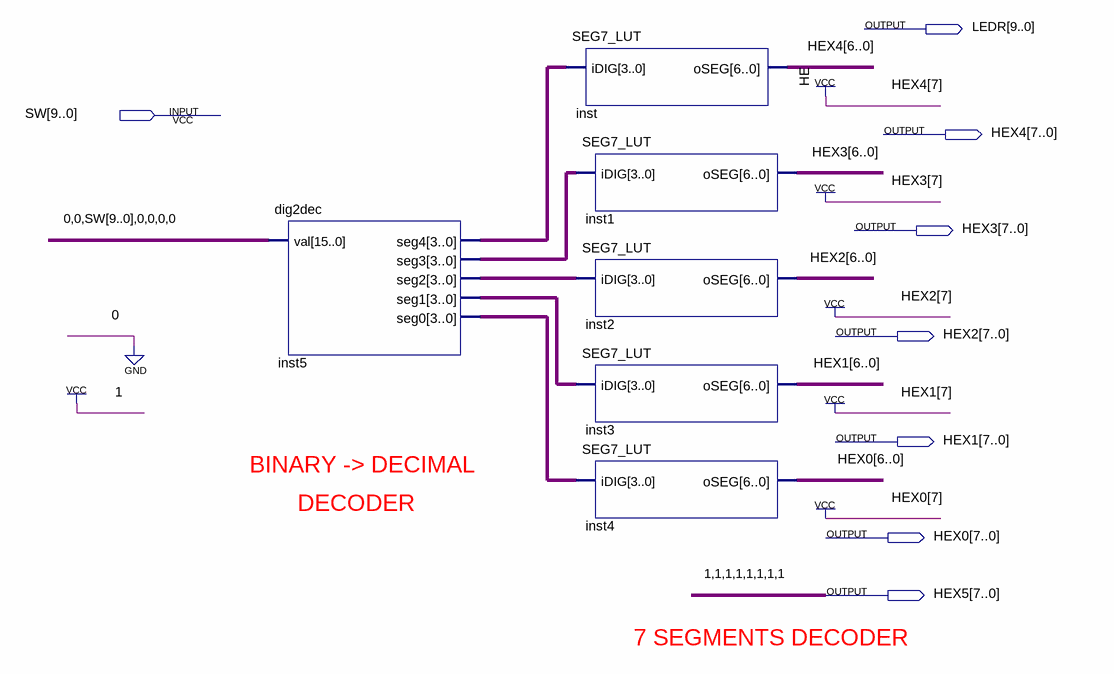
[diagram p0: schematic sheet]
// Quartus schematic digital_decimal.bdf as structural Verilog: 6 symbols, 8 pins
module digital_decimal (
  input  [9:0] SW,
  output [9:0] LEDR,
  output [7:0] HEX4,
  output [7:0] HEX3,
  output [7:0] HEX2,
  output [7:0] HEX1,
  output [7:0] HEX0,
  output [7:0] HEX5
);

  wire [3:0] inst5_seg0, inst5_seg1, inst5_seg2, inst5_seg3, inst5_seg4;

  dig2dec inst5 (
    .val({2'b00, SW, 4'b0000}), .seg4(inst5_seg4), .seg3(inst5_seg3), .seg2(inst5_seg2), .seg1(inst5_seg1),
    .seg0(inst5_seg0));
  SEG7_LUT inst (.iDIG(inst5_seg4), .oSEG(HEX4[6:0]));
  SEG7_LUT inst1 (.iDIG(inst5_seg3), .oSEG(HEX3[6:0]));
  SEG7_LUT inst2 (.iDIG(inst5_seg2), .oSEG(HEX2[6:0]));
  SEG7_LUT inst3 (.iDIG(inst5_seg1), .oSEG(HEX1[6:0]));
  SEG7_LUT inst4 (.iDIG(inst5_seg0), .oSEG(HEX0[6:0]));

  assign HEX0[7] = 1'b1;
  assign HEX1[7] = 1'b1;
  assign HEX2[7] = 1'b1;
  assign HEX3[7] = 1'b1;
  assign HEX4[7] = 1'b1;
  assign HEX5 = {8{1'b1}};

  // Notes on the sheet:
  //   BINARY -> DECIMAL
  //   DECODER
  //   7 SEGMENTS DECODER
endmodule
